# Altium schematic sheet OutputBlockConnector.SchDoc
size A4
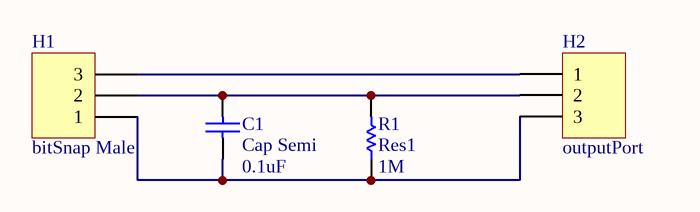
[diagram p0: OutputBlockConnector.SchDoc]

## Parts
C1  Cap Semi  value 0.1uF  [CAPC3216L]
H1  bitSnap Male  [HDR1X3]
H2  outputPort  [HDR1X3]
R1  Res1  value 1M  [AXIAL-0.3]

## Nets
NetC1_1: C1.1 H1.1 H2.3 R1.1
NetC1_2: C1.2 H1.2 H2.2 R1.2
NetH1_3: H1.3 H2.1

## Library data of the parts
C1 = Cap Semi: Capacitor (Semiconductor SIM Model); Published: 8-Jun-2000; LatestRevisionDate: 29-May-2009; LatestRevisionNote: IPC-7351 Footprint Added.; PackageReference: C1206; Publisher: Altium Limited; PackageDescription: Chip Capacitor
H1 H2 = Header 3: Header, 3-Pin; LatestRevisionDate: 17-Jul-2002; LatestRevisionNote: Re-released for DXP Platform.; Publisher: Altium Limited
R1 = Res1: Resistor; Published: 8-Jun-2000; LatestRevisionDate: 17-Jul-2002; LatestRevisionNote: Re-released for DXP Platform.; PackageReference: AXIAL-0.3; Publisher: Altium Limited